# EAGLE design Puzzle_LED (EAGLE 6.2)
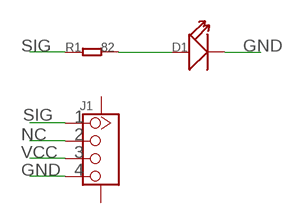
[diagram p0: schematic, sheet 1]

## Parts
D1  LED-6MM  [LED-2P-2.54-6MM]
J1  TWIG-4P-2.0-SMD-FEMALE-REINFORCE'90D'  [4P-SMD-2.0-90D]
R1  82  R-0603  [0603]

## Nets
GND: D1.- J1.4
N$1: D1.+ R1.2
NC: J1.2
SIG: J1.1 R1.1
VCC: J1.3
Unconnected: J1.SS1 J1.SS2

## Notes on the sheet
- SIG | GND
- SIG | 1
- NC | 2
- VCC | 3
- GND | 4

## Library data of the parts
D1 = Discrete:LED*
J1 = Connector4pin-dip:TWIG-4P-2.0-SMD-FEMALE-REINFORCE
R1 = Discrete:R*

## Board
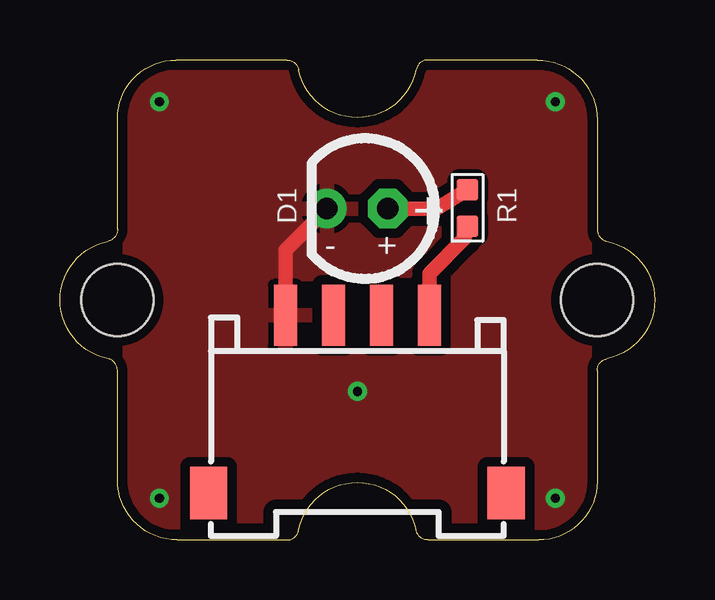
[diagram p1: board, top side]
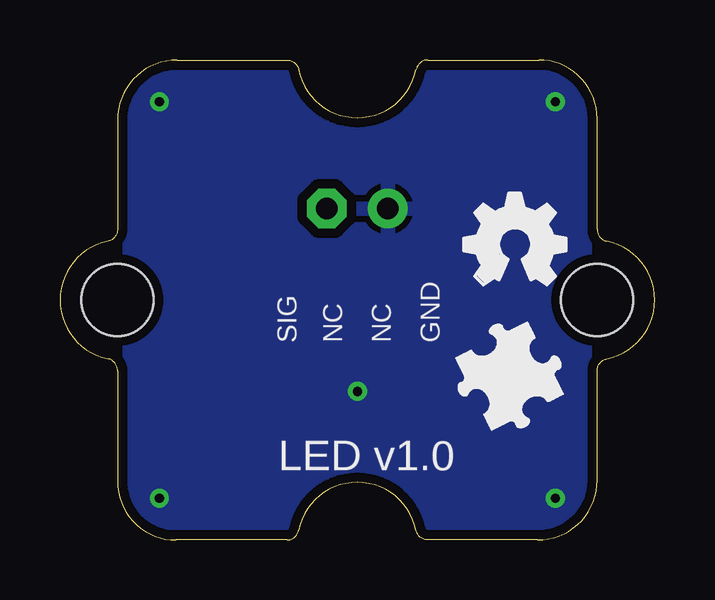
[diagram p2: board, bottom side, seen from below]

Size 24.8 x 20 mm. Coordinates in mm from the lower left corner, seen from the top.
Copper layers (1*16): Top 0.035mm / dielectric 1.5mm / Bottom 0.035mm
Design rules "default": minimum track width 10mil, minimum drill 12mil, track to track 8mil, track to pad 8mil, pad to pad 8mil, via to via 8mil, smd to smd 8mil, copper to edge 10mil, drill to drill 8mil, minimum pad ring 10mil, minimum via ring 8mil, stop-mask expansion 4mil, vias tented up to drill 100mil, thermal gap 10mil

### Footprints (pad centres in the part's own frame; a part is rotated, then mirrored left to right if it is on the bottom)
LED-2P-2.54-6MM = drill 0.889 pad 1.651 octagon: + -1.27,0 | drill 0.889 pad 1.651: - 1.27,0
4P-SMD-2.0-90D = smd 0.965 x 2.54: 1 -3,0; 2 -1,0; 3 1,0; 4 3,0 | smd 1.55 x 2.184: SS1 -6.2,7.4; SS2 6.2,7.4
0603 = smd 0.889 x 0.889: 1 -0.762,0; 2 0.762,0
DZJM-B20-1P = hole 3: 0,10; 0,-10

### Placement (x,y rotation side)
D1  12.4,13.81 180 top
J1  12.4,9.36 180 top
R1  17,13.84 90 top
U$2  [BRICK-LOGO-MIL-0.5]  8.59,4.29 0 bottom
U$3  [OSHW_FILLX150_NOTEXT_S]  7.96,10.63 0 bottom
U$4  [DZJM-B20-1P]  12.4,10 90 top

### Tracks (layer width: path | path; a pad name or v marks a point on that pad's centre or on a via)
GND  (via drill 0.38)
  Top 0.61: J1.4 9.4,12.08 D1.-
  other vias: 4.15,18.25 20.66,18.25 12.4,6.19 20.66,1.74 4.15,1.74
  pour Top (isolate 0.406): 0.34,20.16 23.58,20.16 arc-90 24.47,19.91 24.47,-0.16 0.59,-0.16 arc-90 0.34,0.09
  pour Bottom (isolate 0.406): 0.34,20.16 23.58,20.16 arc-90 24.47,19.91 24.47,-0.16 0.59,-0.16 arc-90 0.34,0.09
N$1
  Top 0.61: D1.+ 15.7,13.81 R1.2
SIG
  Top 0.61: J1.1 15.4,11.09 16.87,12.56 R1.1

### Text on the board
tPlace: +
bPlace: GND | NC | NC | SIG | LED v1.0